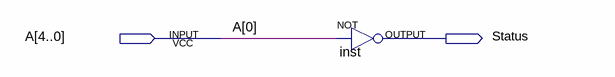
[diagram p0: schematic sheet]
// Quartus schematic status-par.bdf as structural Verilog: 1 symbols, 2 pins
module \status-par  (
  input  [4:0] A,
  output Status
);

  // NOT inst has open pins: IN=A[0], OUT=open
endmodule
